# EAGLE design breakout (EAGLE 6.6.0)
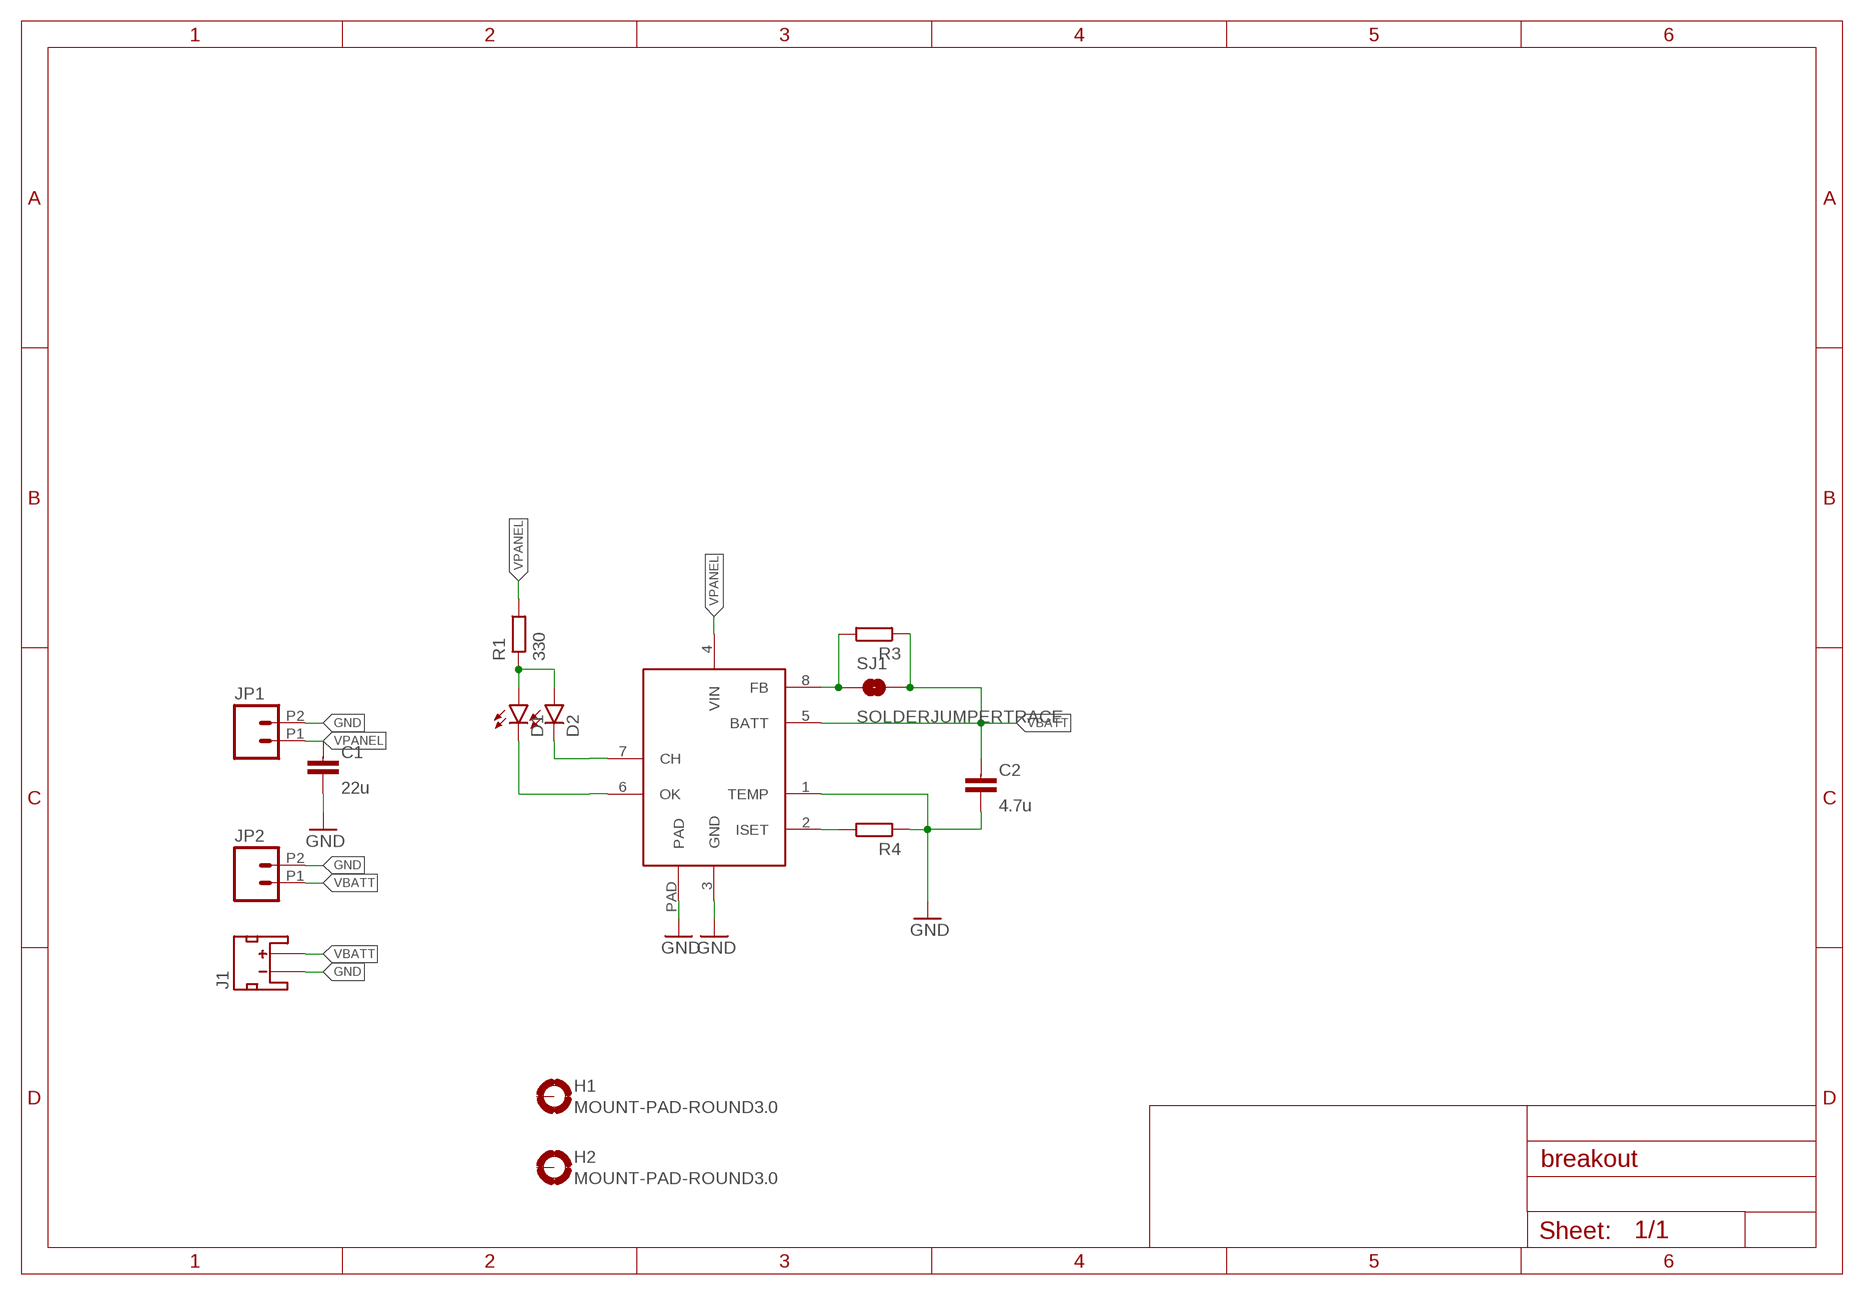
[diagram p0: schematic, sheet 1]

## Parts
C1  22u  CAPACITOR0603-N  [C0603-N]
C2  4.7u  CAPACITOR0603-N  [C0603-N]
D1  LED0603  [LED-0603]
D2  LED0603  [LED-0603]
H1  MOUNT-PAD-ROUND3.0  [3,0-PAD]
H2  MOUNT-PAD-ROUND3.0  [3,0-PAD]
J1  JST_2MM_MALE_TH  [JST-2-TH]
JP1  M022.54MM_SCREWTERM  [1X02_2.54_SCREWTERM]
JP2  M022.54MM_SCREWTERM  [1X02_2.54_SCREWTERM]
R1  330  RESISTOR0603-N  [R0603-N]
R3  RESISTOR0603-N  [R0603-N]
R4  RESISTOR0603-N  [R0603-N]
SJ1  SOLDERJUMPERTRACE  [SJ_2S-TRACE]
U1  CN3083  [SO8-PAD]

## Nets
GND: C1.2 C2.2 J1.2(-) JP1.P2 JP2.P2 R4.1 U1.1(TEMP) U1.3(GND) U1.PAD
N$2: D1.A D2.A R1.1
N$6: R4.2 U1.2(ISET)
N$7: D2.C U1.7(CH)
N$8: D1.C U1.6(OK)
N$9: R3.2 SJ1.1 U1.8(FB)
VBATT: C2.1 J1.1(+) JP2.P1 R3.1 SJ1.2 U1.5(BATT)
VPANEL: C1.1 JP1.P1 R1.2 U1.4(VIN)
Unconnected: H1.B3,0(MOUNT) H2.B3,0(MOUNT)

## Library data of the parts
C1 C2 = passives-7351:CAPACITOR
D1 D2 = SparkFun-LED:LED: LEDs Standard schematic elements and footprints for 5mm, 3mm, 1206, and 0603 sized LEDs. 5mm - Spark Fun Electronics SKU : COM-00529 (and others)
H1 H2 = dtb:MOUNT-PAD-ROUND: MOUNTING PAD, round
J1 = dtb:JST_2MM_MALE_TH: Mates to single-cell LiPo batteries. CONN-08352
JP1 JP2 = SparkFun-Connectors:M02: Standard 2-pin 0.1" header. Use with - straight break away headers ( PRT-00116) - right angle break away headers (PRT-00553) - swiss pins (PRT-00743) - machine pins (PRT-00117) - female headers (PRT-00115) Molex polarized connector foot print use with: PRT-08233 with associated crimp pins and housings. 2.54_SCREWTERM for use with PRT-10571. 3.5mm Screw Terminal footprints for PRT-08084 5mm Screw Terminal footprints for use with PRT-08432
R1 R3 R4 = passives-7351:RESISTOR
SJ1 = SparkFun-Retired:SOLDERJUMPER: Solder Jumper Standard SMD solder jumper. Used to automate production. Two varients : Normally Open and Normally Closed are the same, but have different paste layers. NC will have a large amount of paste and should jumper during reflow.
U1 = jonsowman:CN3083

## Board
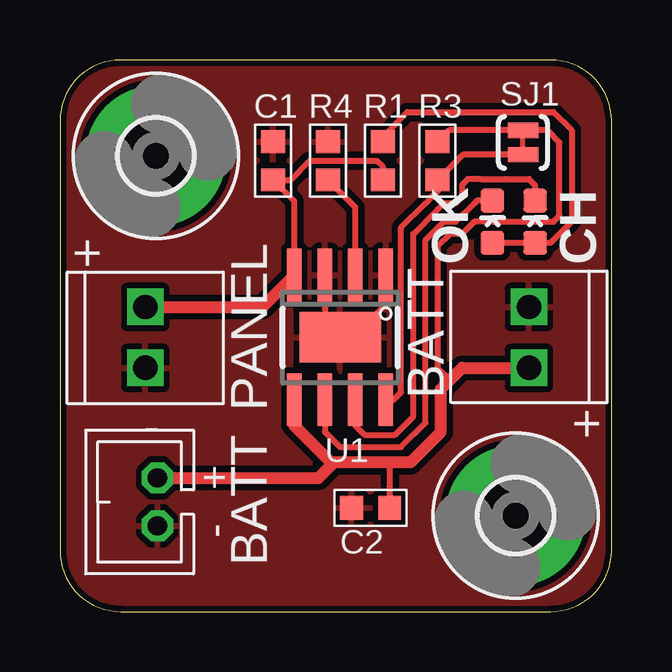
[diagram p1: board, top side]
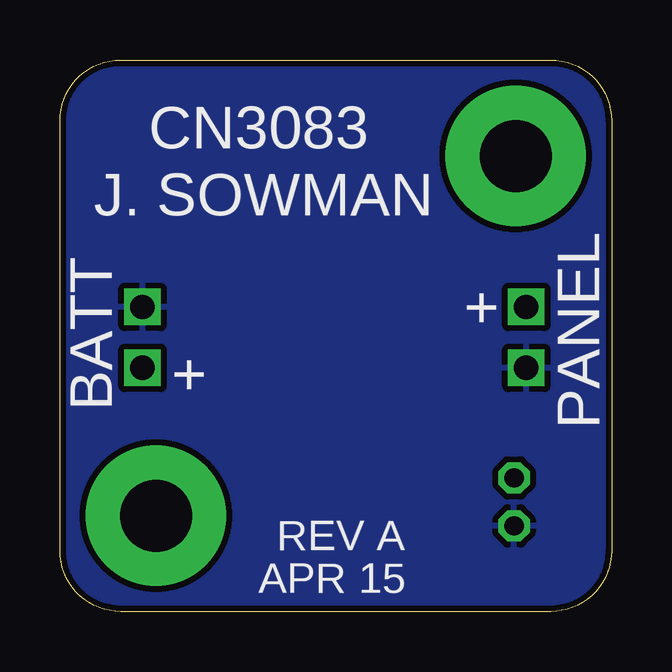
[diagram p2: board, bottom side, seen from below]

Size 23 x 23 mm. Coordinates in mm from the lower left corner, seen from the top.
Outline: 0,20.46 0,2.54 arc90 2.54,0 20.46,0 arc90 23,2.54 23,20.46 arc90 20.46,23 2.54,23 arc90 0,20.46
Copper layers (1*16): Top 0.035mm / dielectric 1.5mm / Bottom 0.035mm
Design rules "SeeedStudio_2layer_DRU_no_angle_20140221 *": minimum track width 6mil, minimum drill 12mil, track to track 6mil, track to pad 6mil, pad to pad 6mil, via to via 6mil, smd to smd 0mil, copper to edge 10mil, drill to drill 10mil, minimum pad ring 10mil, minimum via ring 6mil, stop-mask expansion 2mil, vias tented up to drill 100mil, thermal gap 10mil

### Footprints (pad centres in the part's own frame; a part is rotated, then mirrored left to right if it is on the bottom)
C0603-N = smd 0.95 x 1: 1 -0.8,0; 2 0.8,0
LED-0603 = smd 1 x 1: A 0,-0.877; C 0,0.877
3,0-PAD = drill 3 pad 5.842: B3,0 0,0
JST-2-TH = drill 0.8 octagon: 1 1,0; 2 -1,0
1X02_2.54_SCREWTERM = drill 1.016 square: P1 2.54,0; P2 0,0
R0603-N = smd 0.95 x 1: 1 -0.8,0; 2 0.8,0
SJ_2S-TRACE = smd 0.635 x 1.27: 1 -0.508,0; 2 0.508,0
SO8-PAD = smd 0.6 x 2.2: 1 -1.905,-2.6; 2 -0.635,-2.6; 3 0.635,-2.6; 4 1.905,-2.6; 5 1.905,2.6; 6 0.635,2.6; 7 -0.635,2.6; 8 -1.905,2.6 | smd 3.4 x 2.1: PAD 0,0

### Placement (x,y rotation side)
C1  8.89,18.8 90 top
C2  12.95,4.32 180 top
D1  18.03,16.26 0 top
D2  19.81,16.26 0 top
H1  4,19 0 top
H2  19,4 0 top
J1  4.06,4.57 90 top
JP1  3.56,10.16 90 top
JP2  19.56,12.7 270 top
R1  13.46,18.8 270 top
R3  15.75,18.8 270 top
R4  11.18,18.8 270 top
SJ1  19.3,19.56 90 top
U1  11.68,11.43 180 top

### Tracks (layer width: path | path; a pad name or v marks a point on that pad's centre or on a via)
GND
  Top 0.254: U1.3 11.05,12.06 U1.PAD 12.45,12.19 12.95,12.19 13.59,12.83 U1.1
  pour Top (isolate 0.254): -0.25,23.11 23.11,23.11 23.11,0 -0.25,0
  pour Bottom (isolate 0.254): -0.25,23.11 23.11,23.11 23.11,0 -0.25,0
N$2
  Top 0.254: D1.A D2.A 20.46,15.38 20.57,15.49 21.34,16.26 21.34,20.07 20.57,20.83 14.48,20.83 13.46,19.81 R1.1
N$6
  Top 0.254: U1.2 12.32,16.85 R4.2
N$7
  Top 0.254: U1.7 12.32,7.75 12.7,7.37 13.97,7.37 14.73,8.13 14.73,14.87 14.73,15.75 15.75,16.76 16,17.02 16.51,17.02 16.76,17.27 16.76,17.78 17.02,18.03 17.53,18.03 18.54,18.03 19.56,18.03 19.81,17.78 D2.C
N$8
  Top 0.254: U1.6 11.05,7.49 11.68,6.86 14.22,6.86 15.24,7.87 15.24,15.49 16,16.26 16.51,16.26 17.27,17.02 17.39,17.13 17.89,17.13 D1.C
N$9
  Top 0.254: U1.8 13.91,8.83 14.22,9.14 14.22,16 15.24,17.02 15.49,17.27 15.75,17.53 R3.2 16.8,19.05 SJ1.1
VBATT
  Top 0.254: R3.1 16.22,20.07 SJ1.2 20.32,20.07 20.83,19.56 20.83,16.51 20.57,16.26 18.03,16.26 17.27,16.26 16.76,15.75 16.26,15.75 15.75,15.24 15.75,10.16 16.26,9.65 | C2.1 13.75,6.18 13.72,6.22
  Top 0.508: 11.43,6.22 12.45,6.22 13.72,6.22 14.61,6.22 15.88,7.49 15.88,9.27 16.26,9.65 16.76,10.16 JP2.P1 | 11.43,6.22 11.3,6.22 9.78,7.75 U1.5 | J1.1 10.78,5.57 11.43,6.22
VPANEL
  Top 0.254: U1.4 9.78,17.11 C1.1 9.61,18 10.41,18.8 13.17,18.8 13.21,18.8 13.46,18.54 R1.2
  Top 0.508: JP1.P1 8.45,12.7 U1.4

### Text on the board
tPlace: + | OK | CH | BATT | PANEL | BATT | +
bPlace: CN3083 | J. SOWMAN | + | + | PANEL | BATT | REV A | APR 15